# EAGLE schematic 5v_PS_V02 (EAGLE 9.2.2)
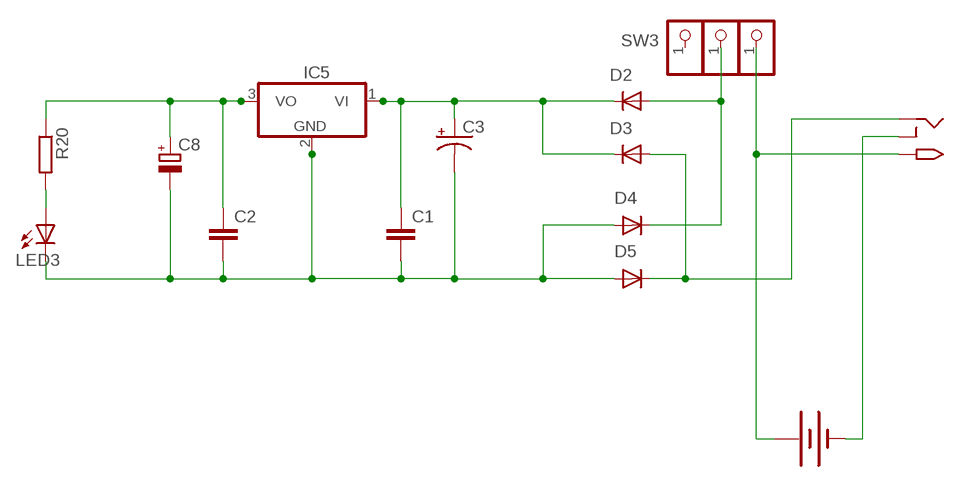
[diagram p0: schematic, sheet 1]

## Parts
BAT1  BATTERY  [PP3_BATTERBOX]
C1  330nf  C-EU025-024X044  [C025-024X044]
C2  100nf  C-EU025-024X044  [C025-024X044]
C3  2200uf  CPOL-USE5-10.5  [E5-10,5]
C8  10uf  CPOL-EUE2.5-7  [E2,5-7]
D2  1N4004  [DO-VERT]
D3  1N4004  [DO-VERT]
D4  1N4004  [DO-VERT]
D5  1N4004  [DO-VERT]
IC5  7805TV  [TO220V]
J1  2.1MMJACKTHM  [PJ-102A]
LED3  LED3MM  [LED3MM]
ONOFF  PINHD-1X1  [1X01]
R20  1k  R-EU_0207/7  [0207/7]
SW2  PINHD-1X1  [1X01]
SW3  PINHD-1X1  [1X01]

## Nets
N$19: LED3.A R20.2
N$22: D3.A D5.C J1.RING
N$23: C2.1 C8.+ IC5.3(VO) R20.1
N$24: C1.2 C2.2 C3.- C8.- D4.A D5.A IC5.2(GND) LED3.K(C)
N$54: D2.A D4.C ONOFF.1
N$56: BAT1.0V(-) J1.RING_SW
PWR+: BAT1.9V(+) J1.TIP SW2.1
VIN: C1.1 C3.+ D2.C D3.C IC5.1(VI)
Unconnected: SW3.1

## Library data of the parts
BAT1 = jasons_stuff:BATTERY: Battery Holders Various common sizes : AA, AAA, 20mm coin cell and 12mm coin cell.
C1 C2 = rcl:C-EU: CAPACITOR, European symbol
C3 = adafruit:CPOL-US: POLARIZED CAPACITOR, American symbol
C8 = rcl:CPOL-EU: POLARIZED CAPACITOR, European symbol
D2-D5 = jasons_stuff:1N4004: DIODE general purpose rectifier, 1 A
IC5 = linear:78*: Positive VOLTAGE REGULATOR Source: http://cache.national.com/ds/LM/LM78L05.pdf http://www.fairchildsemi.com/ds/LM/LM7805.pdf
J1 = adafruit:2.1MMJACK: 2.1mm x 5.5mm THM DC jack with internal switch. Digikey part #PJ-102A, 4UCON part #05537 2.1mm x 5.5mm SMT DC jack with internal switch. Digikey part #PJ-002A-SMT, 4UCON part #03267 By microbuilder.eu & adafruit.com
LED3 = adafruit:LED: LED OSRAM: - CHIPLED LG R971, LG N971, LY N971, LG Q971, LY Q971, LO R971, LY R971 LH N974, LH R974 LS Q976, LO Q976, LY Q976 LO Q996 - Hyper CHIPLED LW Q18S LB Q993, LB Q99A, LB R99A - SideLED LS A670, LO A670, LY A670, LG A670, LP A670 LB A673, LV A673, LT A673, LW A673 LH A674 LY A675 LS A676, LA A676, LO A676, LY A676, LW A676 LS A679, LY A679, LG A679 - Hyper Micro SIDELED® LS Y876, LA Y876, LO Y876, LY Y876 LT Y87S - SmartLED LW L88C, LW L88S LB L89C, LB L89S, LG L890 LS L89K, LO L89K, LY L89K LS L896, LA L896, LO L896, LY L896 - TOPLED LS T670, LO T670, LY T670, LG T670, LP T670 LSG T670, LSP T670, LSY T670, LOP T670, LYG T670 LG T671, LOG T671, LSG T671 LB T673, LV T673, LT T673, LW T673 LH T674 LS T676, LA T676, LO T676, LY T676, LB T676, LH T676, LSB T676, LW T676 LB T67C, LV T67C, LT T67C, LS T67K, LO T67K, LY T67K, LW E67C LS E67B, LA E67B, LO E67B, LY E67B, LB E67C, LV E67C, LT E67C LW T67C LS T679, LY T679, LG T679 LS T770, LO T770, LY T770, LG T770, LP T770 LB T773, LV T773, LT T773, LW T773 LH T774 LS E675, LA E675, LY E675, LS T675 LS T776, LA T776, LO T776, LY T776, LB T776 LHGB T686 LT T68C, LB T68C - Hyper Mini TOPLED® LB M676 - Mini TOPLED Santana® LG M470 LS M47K, LO M47K, LY M47K Source: http://www.osram.convergy.de/
ONOFF SW2 SW3 = adafruit:PINHD-1X1: Pin header 1x1 for 0.1" spacing With round pins
R20 = rcl:R-EU_: RESISTOR, European symbol